# EAGLE design dcf77kompZDiff (EAGLE 6.4)
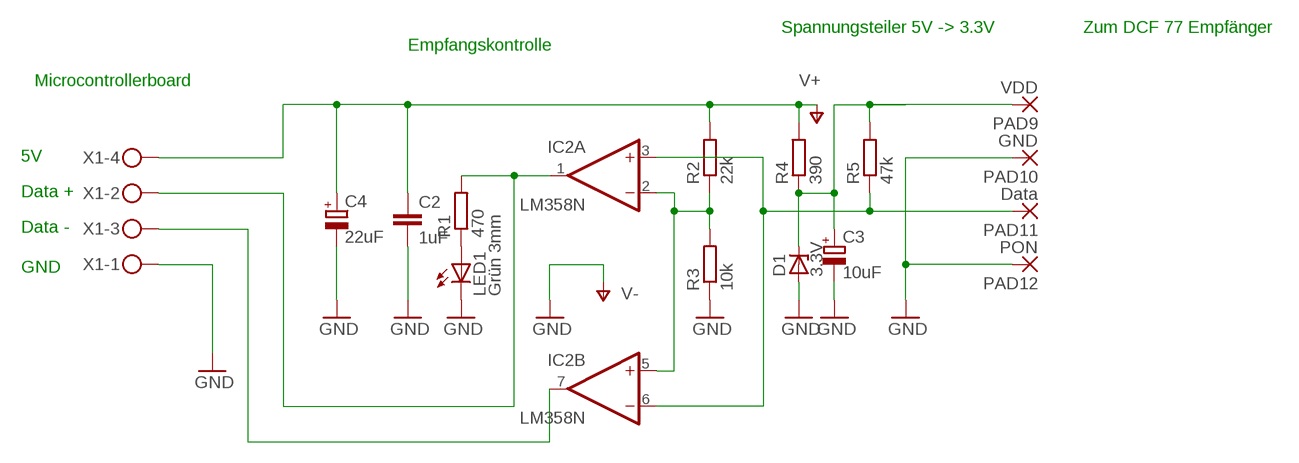
[diagram p0: schematic, sheet 1]

## Parts
C2  1uF  C-EU050-050X075  [C050-050X075]
C3  10uF  CPOL-EUE2.5-5  [E2,5-5]
C4  22uF  CPOL-EUE5-10.5  [E5-10,5]
D1  3.3V  ZENER-DIODEDO34-7  [DO34Z7]
IC2  LM358N  [DIL08]
LED1  Grün 3mm  LED5MM  [LED5MM]
PAD9  VDD  1,6/0,9  [1,6/0,9]
PAD10  GND  1,6/0,9  [1,6/0,9]
PAD11  Data  1,6/0,9  [1,6/0,9]
PAD12  PON  1,6/0,9  [1,6/0,9]
R1  470  R-EU_0207/10  [0207/10]
R2  22k  R-EU_0207/10  [0207/10]
R3  10k  R-EU_0207/10  [0207/10]
R4  390  R-EU_0207/10  [0207/10]
R5  47k  R-EU_0207/10  [0207/10]
X1  MKDSN1,5/4-5,08  [MKDSN1,5/4-5,08]

## Nets
GND: C2.2 C3.- C4.- D1.A LED1.K(C) PAD10.1(P) PAD12.1(P) R3.1 X1.1 ; supply symbol labelled V-
N$1: C3.+ D1.C PAD9.1(P) R4.1 R5.2
N$2: LED1.A R1.1
N$3: IC2.1(A:OUT) R1.2 X1.2
N$4: IC2.7(B:OUT) X1.3
N$5: IC2.2(A:-IN) IC2.5(B:+IN) R2.1 R3.2
N$6: IC2.3(A:+IN) IC2.6(B:-IN) PAD11.1(P) R5.1
V+: C2.1 C4.+ R2.2 R4.2 X1.4

## Notes on the sheet
- Spannungsteiler 5V -> 3.3V | Zum DCF 77 Empfänger
- Empfangskontrolle
- Microcontrollerboard
- 5V
- Data +
- Data -
- GND

## Power pins joined to a net without a drawn wire
GND: IC2.4(P:V-)
V+: IC2.8(P:V+)

## Library data of the parts
C2 = rcl:C-EU: CAPACITOR, European symbol
C3 = rcl:CPOL-EU: POLARIZED CAPACITOR, European symbol
C4 = resistor:CPOL-EU: POLARIZED CAPACITOR, European symbol
D1 = diode:ZENER-DIODE: Z-Diode
IC2 = linear:LM358: OP AMP also LM158; LM258; LM2904 Source: http://cache.national.com/ds/LM/LM158.pdf
LED1 = led:LED: LED OSRAM: - CHIPLED LG R971, LG N971, LY N971, LG Q971, LY Q971, LO R971, LY R971 LH N974, LH R974 LS Q976, LO Q976, LY Q976 LO Q996 - Hyper CHIPLED LW Q18S LB Q993, LB Q99A, LB R99A - SideLED LS A670, LO A670, LY A670, LG A670, LP A670 LB A673, LV A673, LT A673, LW A673 LH A674 LY A675 LS A676, LA A676, LO A676, LY A676, LW A676 LS A679, LY A679, LG A679 - Hyper Micro SIDELED® LS Y876, LA Y876, LO Y876, LY Y876 LT Y87S - SmartLED LW L88C, LW L88S LB L89C, LB L89S, LG L890 LS L89K, LO L89K, LY L89K LS L896, LA L896, LO L896, LY L896 - TOPLED LS T670, LO T670, LY T670, LG T670, LP T670 LSG T670, LSP T670, LSY T670, LOP T670, LYG T670 LG T671, LOG T671, LSG T671 LB T673, LV T673, LT T673, LW T673 LH T674 LS T676, LA T676, LO T676, LY T676, LB T676, LH T676, LSB T676, LW T676 LB T67C, LV T67C, LT T67C, LS T67K, LO T67K, LY T67K, LW E67C LS E67B, LA E67B, LO E67B, LY E67B, LB E67C, LV E67C, LT E67C LW T67C LS T679, LY T679, LG T679 LS T770, LO T770, LY T770, LG T770, LP T770 LB T773, LV T773, LT T773, LW T773 LH T774 LS E675, LA E675, LY E675, LS T675 LS T776, LA T776, LO T776, LY T776, LB T776 LHGB T686 LT T68C, LB T68C - Hyper Mini TOPLED® LB M676 - Mini TOPLED Santana® LG M470 LS M47K, LO M47K, LY M47K Source: http://www.osram.convergy.de LUXEON: - LUMILED® LXK2-PW12-R00, LXK2-PW12-S00, LXK2-PW14-U00, LXK2-PW14-V00 LXK2-PM12-R00, LXK2-PM12-S00, LXK2-PM14-U00 LXK2-PE12-Q00, LXK2-PE12-R00, LXK2-PE12-S00, LXK2-PE14-T00, LXK2-PE14-U00 LXK2-PB12-K00, LXK2-PB12-L00, LXK2-PB12-M00, LXK2-PB14-N00, LXK2-PB14-P00, LXK2-PB14-Q00 LXK2-PR12-L00, LXK2-PR12-M00, LXK2-PR14-Q00, LXK2-PR14-R00 LXK2-PD12-Q00, LXK2-PD12-R00, LXK2-PD12-S00 LXK2-PH12-R00, LXK2-PH12-S00 LXK2-PL12-P00, LXK2-PL12-Q00, LXK2-PL12-R00 Source: www.luxeon.com KINGBRIGHT: KA-3528ASYC Source: www.kingbright.com
PAD9-PAD12 = wirepad:1,6/0,9: THROUGH-HOLE PAD
R1-R5 = resistor:R-EU_: RESISTOR, European symbol
X1 = con-phoenix-508:MKDSN1,5/4-5,08: MKDSN 1,5/ 4-5,08 Printklemme Nennstrom: 13,5 A Nennspannung: 250 V Rastermaß: 5,08 mm Polzahl: 4 Anschlussart: Schraubanschluss Montage: Löten Anschlussrichtung Leiter/Platine: 0 ° Artikelnummer: 1729144 Source: http://eshop.phoenixcontact.com .. 1729144.pdf; MPN: SMKDSN1,5/4-5,08; OC_FARNELL: 1792905; OC_NEWARK: 70R0300

## Board
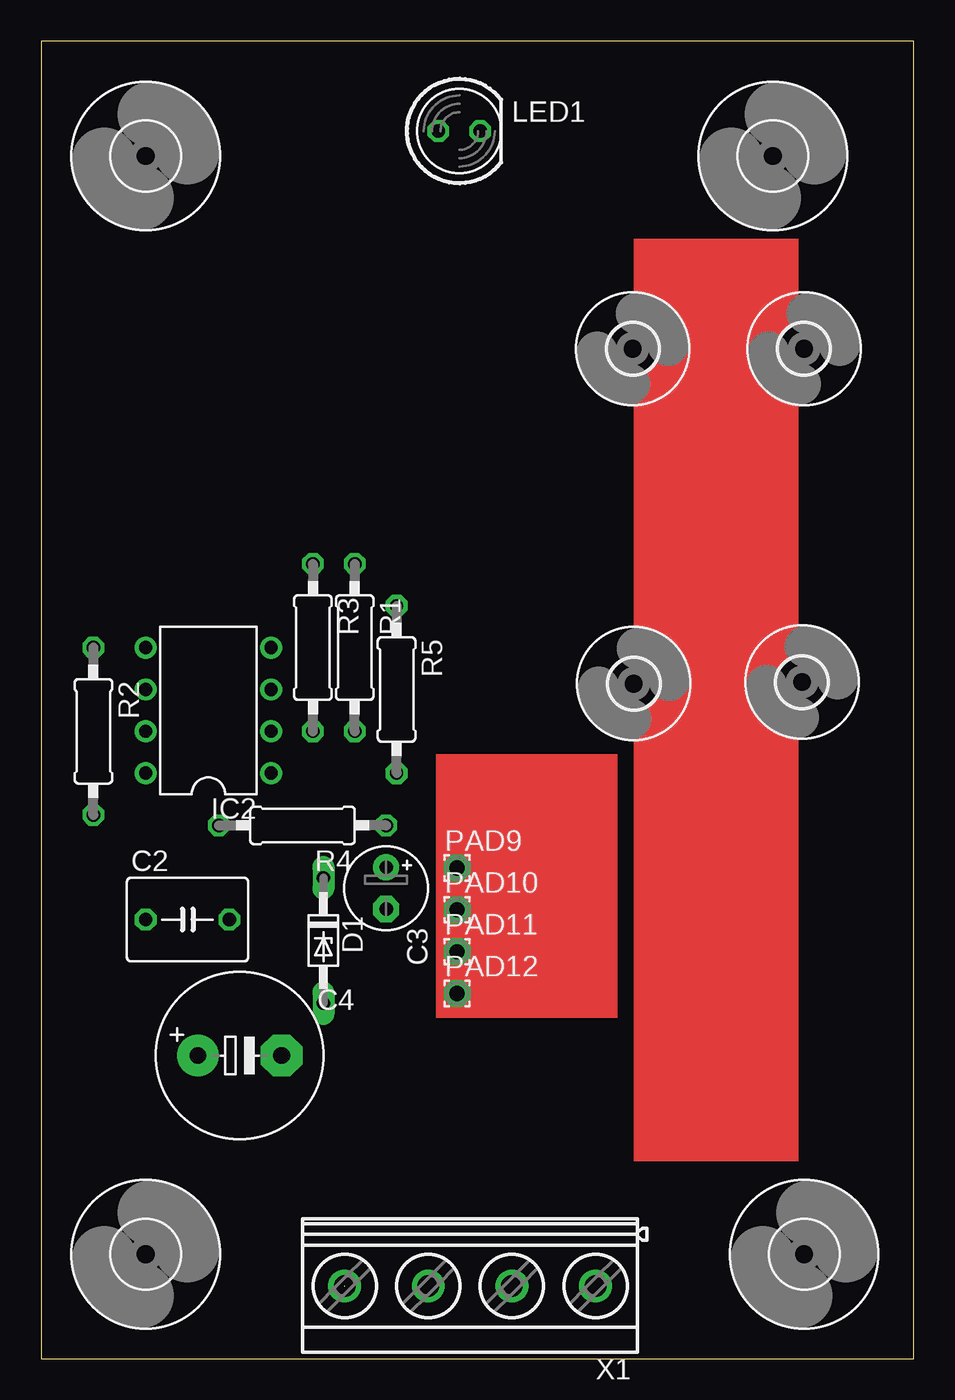
[diagram p1: board, top side]
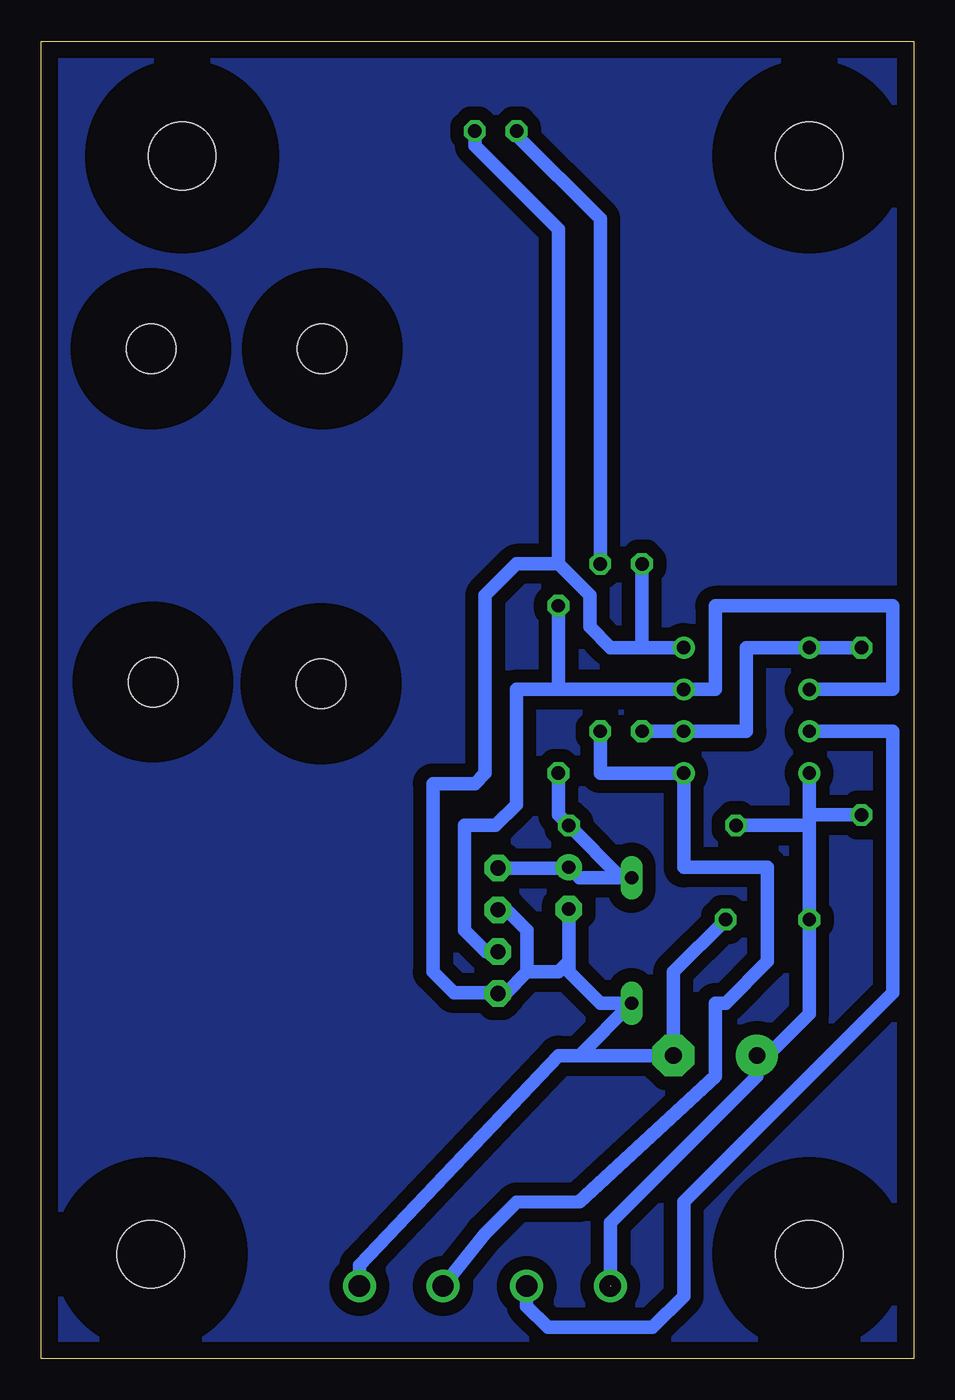
[diagram p2: board, bottom side, seen from below]

Size 53.01 x 80 mm. Coordinates in mm from the lower left corner, seen from the top.
Outline: 0,0 53.01,0 53.01,80 0,80 0,0
Copper layers (1*16): Top 0.035mm / dielectric 1.5mm / Bottom 0.035mm
Design rules "default": minimum track width 10mil, minimum drill 24mil, track to track 8mil, track to pad 8mil, pad to pad 8mil, via to via 8mil, smd to smd 8mil, copper to edge 40mil, drill to drill 8mil, minimum pad ring 10mil, minimum via ring 8mil, stop-mask expansion 4mil, vias tented up to drill 0mil, thermal gap 10mil

### Footprints (pad centres in the part's own frame; a part is rotated, then mirrored left to right if it is on the bottom)
C050-050X075 = drill 0.813 octagon: 1 -2.54,0; 2 2.54,0
E2,5-5 = drill 0.813 pad 1.6: + -1.27,0 | drill 0.813 pad 1.6 octagon: - 1.27,0
E5-10,5 = drill 1.016 pad 2.54: + -2.54,0 | drill 1.016 pad 2.54 octagon: - 2.54,0
DO34Z7 = drill 0.813 long: A 3.81,0; C -3.81,0
DIL08 = drill 0.813 pad 1.27: 1 -3.81,-3.81; 2 -1.27,-3.81; 3 1.27,-3.81; 4 3.81,-3.81; 5 3.81,3.81; 6 1.27,3.81; 7 -1.27,3.81; 8 -3.81,3.81
LED5MM = drill 0.813 octagon: A -1.27,0; K 1.27,0
1,6/0,9 = drill 0.914 pad 1.6 octagon: 1 0,0
0207/10 = drill 0.813 octagon: 1 -5.08,0; 2 5.08,0
4,1 = hole 4.1: 0,0
3,0 = hole 3: 0,0
MKDSN1,5/4-5,08 = drill 1.3 pad 2: 1 -7.641,0.025; 2 -2.561,0.025; 3 2.519,0.025; 4 7.599,0.025

### Placement (x,y rotation side)
C2  8.89,26.67 0 top
C3  20.95,28.57 270 top
C4  12.06,18.41 0 top
D1  17.14,25.4 270 top
IC2  10.16,39.37 90 top
LED1  25.4,74.55 0 top
PAD9  25.27,29.8 0 top
PAD10  25.27,27.26 0 top
PAD11  25.27,24.72 0 top
PAD12  25.27,22.18 0 top
R1  19.05,43.18 270 top
R2  3.17,38.1 270 top
R3  16.51,43.18 270 top
R4  15.88,32.38 180 top
R5  21.59,40.64 270 top
U$1  [4,1]  6.35,73.03 0 top
U$2  [4,1]  44.45,73.03 0 top
U$3  [4,1]  46.35,6.35 0 top
U$4  [4,1]  6.35,6.35 0 top
U$5  [3,0]  36,40.99 0 top
U$6  [3,0]  46.22,41.09 0 top
U$7  [3,0]  35.94,61.33 0 top
U$8  [3,0]  46.34,61.33 0 top
X1  26.04,4.45 180 top

### Tracks (layer width: path | path; a pad name or v marks a point on that pad's centre or on a via)
GND
  Bottom 0.813: X1.1 33.68,5.69 21.59,18.41 20.32,18.41 | 20.32,18.41 C4.- 14.61,23.5 C2.2 | IC2.4 16.51,43.18 | 16.51,43.18 R3.1 | 20.32,18.41 D1.A 19.05,21.59 20.95,23.5 20.95,24.13 | 23.5,23.5 23.5,26.04 24.77,27.3 25.4,27.3 25.36,27.26 PAD10.1 | 23.5,23.5 24.81,22.18 PAD12.1 25.32,22.23 27.94,22.23 29.21,23.5 29.21,34.92 26.67,34.92 26.04,35.56 26.04,46.35 24.13,48.26 21.59,48.26 | 23.5,23.5 21.59,23.5 20.95,24.13 | 20.95,24.13 C3.- | 16.51,43.18 18.41,43.18 19.68,44.45 19.68,46.35 21.59,48.26 | LED1.K 26.67,73.66 21.59,68.58 21.59,48.26
N$1
  Bottom 0.813: R5.2 21.59,33.02 R4.1 17.78,29.21 D1.C 20.32,29.21 C3.+ 21,29.8 PAD9.1
N$2
  Bottom 0.813: R1.1 19.05,69.22 24.13,74.3 LED1.A
N$3
  Bottom 0.813: X1.2 26.06,7.59 24.13,9.5 20.32,9.53 12.06,17.14 12.06,21.59 11.43,21.59 8.89,24.13 8.89,29.84 13.97,29.84 IC2.1 19.05,35.56 R1.2
N$4
  Bottom 0.813: X1.3 23.52,3.2 22.23,1.91 15.88,1.91 13.97,3.81 13.97,9.53 1.27,22.23 1.27,38.1 IC2.7
N$5
  Bottom 0.813: R3.2 IC2.2 10.16,38.1 10.16,43.18 IC2.5 R2.1
N$6
  Bottom 0.813: IC2.6 1.27,40.64 1.27,45.72 12.06,45.72 12.06,40.64 IC2.3 21.59,40.64 | R5.1 21.59,40.64 | PAD11.1 25.99,24.72 27.3,26.04 27.3,32.38 25.4,32.38 24.13,33.66 24.13,40.64 21.59,40.64
N$7
  pour Bottom (isolate 0.813): 0,80.01 52.7,80.01 52.7,0 0,0
V+  (1 unrouted)
  Bottom 0.813: 18.41,4.45 18.41,8.26 9.53,17.14 C4.+ 8.89,18.41 6.35,20.95 C2.1 6.35,32.38 | 6.35,32.38 6.35,33.02 | 6.35,33.02 R2.2 | IC2.8 6.35,33.02 | R4.2 6.35,32.38
(copper drawn outside any net)
  shapes: Top area x2